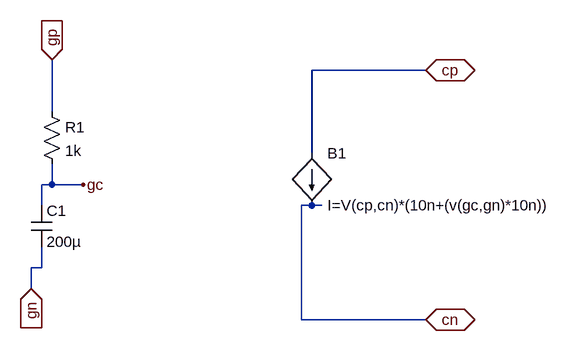
[diagram p0: schematic capteurgaz.asc]
capteurgaz.asc, the LTspice schematic file:
Version 4
SHEET 1 880 680
WIRE 528 16 352 16
WIRE -48 80 -48 0
WIRE 352 144 352 16
WIRE -48 192 -48 160
WIRE -48 192 -64 192
WIRE 0 192 -48 192
WIRE -64 224 -64 192
WIRE 352 224 336 224
WIRE 368 224 352 224
WIRE -64 320 -64 288
WIRE -64 320 -80 320
WIRE -80 352 -80 320
WIRE 336 400 336 224
WIRE 528 400 336 400
FLAG -48 0 gp
IOPIN -48 0 In
FLAG -80 352 gn
IOPIN -80 352 In
FLAG 0 192 gc
FLAG 528 16 cp
IOPIN 528 16 BiDir
FLAG 528 400 cn
IOPIN 528 400 BiDir
SYMBOL res -64 64 R0
SYMATTR InstName R1
SYMATTR Value 1k
SYMBOL cap -80 224 R0
SYMATTR InstName C1
SYMATTR Value 200µ
SYMBOL bi 352 144 R0
SYMATTR InstName B1
SYMATTR Value I=V(cp,cn)*(10n+(v(gc,gn)*10n))

The netlist it stands for:
* capteurgaz.asc
R1 gp gc 1k
C1 gc gn 200µ
B1 cp cn I=V(cp,cn)*(10n+(v(gc,gn)*10n))
.backanno
.end